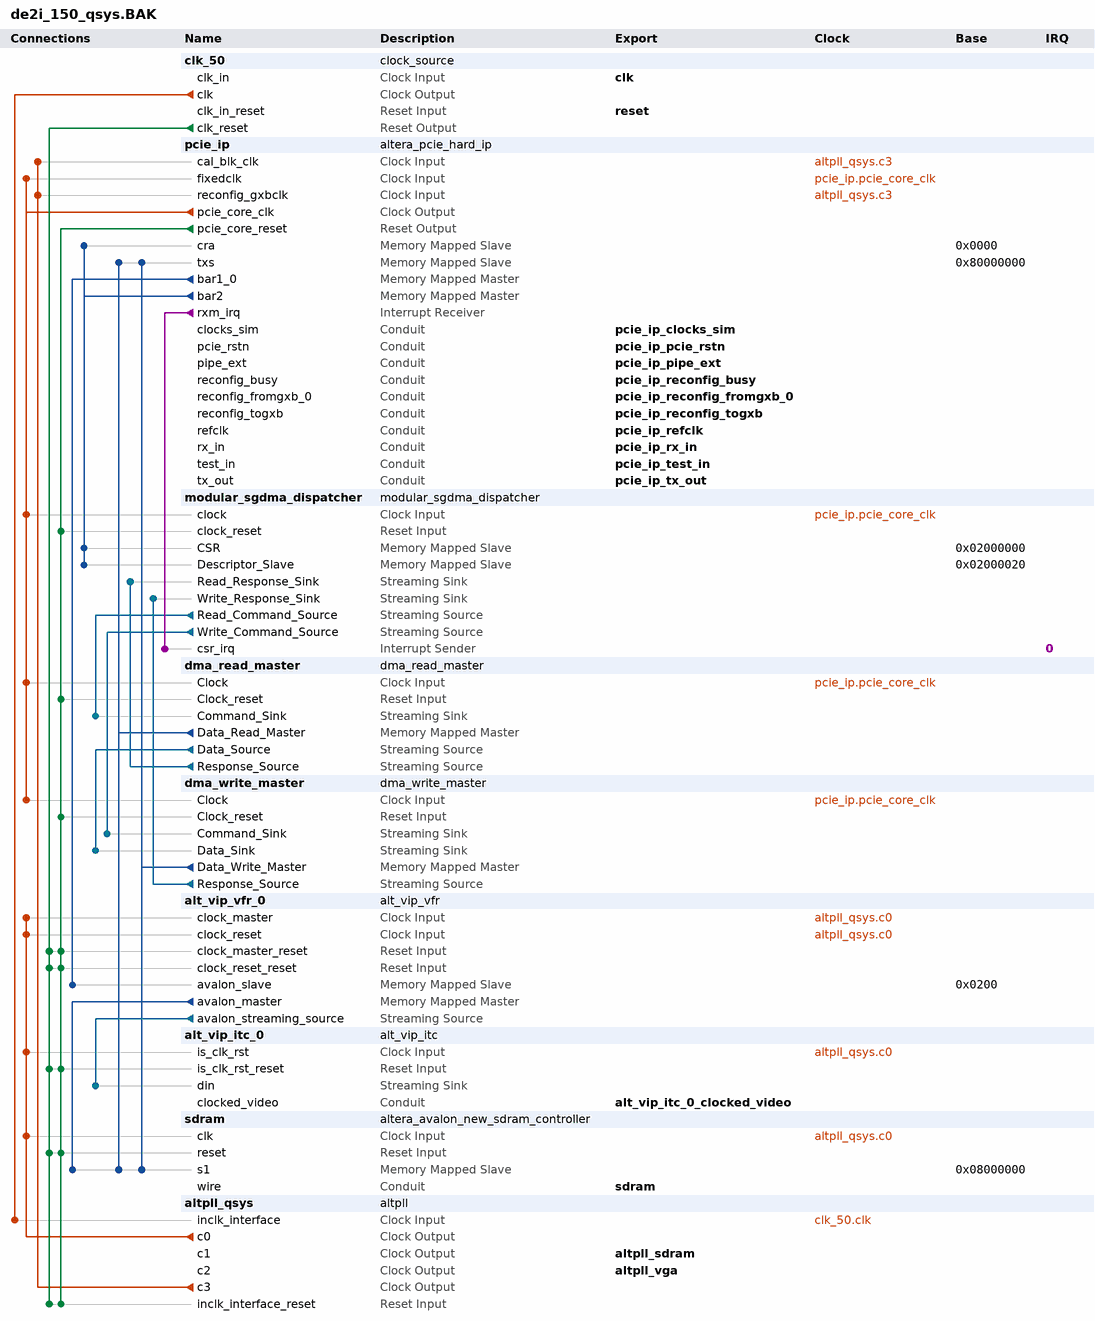
[diagram p0: system contents]
# Platform Designer (Qsys) system de2i_150_qsys.BAK, Cyclone IV GX EP4CGX150DF31C7
# Parameters at their usual value, and those the tool derives, are not listed.
package require -exact qsys 17.1
create_system de2i_150_qsys.BAK
set_project_property DEVICE_FAMILY {Cyclone IV GX}
set_project_property DEVICE EP4CGX150DF31C7

add_instance clk_50 clock_source 17.1
set_instance_parameter_value clk_50 clockFrequency 50000000

add_instance pcie_ip altera_pcie_hard_ip 17.1
set_instance_parameter_value pcie_ip {BAR Type} {64 bit Prefetchable,Not used,32 bit Non-Prefetchable,Not used,Not used,Not used}
set_instance_parameter_value pcie_ip CB_A2P_ADDR_MAP_IS_FIXED 0
set_instance_parameter_value pcie_ip CB_A2P_ADDR_MAP_NUM_ENTRIES 2
set_instance_parameter_value pcie_ip CB_A2P_ADDR_MAP_PASS_THRU_BITS 24
set_instance_parameter_value pcie_ip CG_ENABLE_A2P_INTERRUPT 0
set_instance_parameter_value pcie_ip CG_NO_CPL_REORDERING 0
set_instance_parameter_value pcie_ip {PCIe Address 31:0} 0x00000000,0x00000000,0x00000000,0x00000000,0x00000000,0x00000000,0x00000000,0x00000000,0x00000000,0x00000000,0x00000000,0x00000000,0x00000000,0x00000000,0x00000000,0x00000000
set_instance_parameter_value pcie_ip {PCIe Address 63:32} 0x00000000,0x00000000,0x00000000,0x00000000,0x00000000,0x00000000,0x00000000,0x00000000,0x00000000,0x00000000,0x00000000,0x00000000,0x00000000,0x00000000,0x00000000,0x00000000
set_instance_parameter_value pcie_ip class_code 0
set_instance_parameter_value pcie_ip device_id 57345
set_instance_parameter_value pcie_ip my_advanced_errors false
set_instance_parameter_value pcie_ip my_enable_ecrc_check false
set_instance_parameter_value pcie_ip my_enable_ecrc_gen false
set_instance_parameter_value pcie_ip p_pcie_test_out_width None
set_instance_parameter_value pcie_ip p_user_msi_enable 0
set_instance_parameter_value pcie_ip subsystem_device_id 4
set_instance_parameter_value pcie_ip subsystem_vendor_id 4466
set_instance_parameter_value pcie_ip vendor_id 4466

add_instance modular_sgdma_dispatcher modular_sgdma_dispatcher 17.1
set_instance_parameter_value modular_sgdma_dispatcher BURST_ENABLE 0
set_instance_parameter_value modular_sgdma_dispatcher BURST_WRAPPING_SUPPORT 0
set_instance_parameter_value modular_sgdma_dispatcher CSR_ADDRESS_WIDTH 3
set_instance_parameter_value modular_sgdma_dispatcher DATA_FIFO_DEPTH 32
set_instance_parameter_value modular_sgdma_dispatcher DATA_WIDTH 32
set_instance_parameter_value modular_sgdma_dispatcher DESCRIPTOR_FIFO_DEPTH 8
set_instance_parameter_value modular_sgdma_dispatcher ENHANCED_FEATURES 0
set_instance_parameter_value modular_sgdma_dispatcher GUI_RESPONSE_PORT 2
set_instance_parameter_value modular_sgdma_dispatcher MAX_BURST_COUNT 2
set_instance_parameter_value modular_sgdma_dispatcher MAX_BYTE 1024
set_instance_parameter_value modular_sgdma_dispatcher MAX_STRIDE 1
set_instance_parameter_value modular_sgdma_dispatcher MODE 0
set_instance_parameter_value modular_sgdma_dispatcher PREFETCHER_USE_CASE 0
set_instance_parameter_value modular_sgdma_dispatcher PROGRAMMABLE_BURST_ENABLE 0
set_instance_parameter_value modular_sgdma_dispatcher STRIDE_ENABLE 0
set_instance_parameter_value modular_sgdma_dispatcher TRANSFER_TYPE {Aligned Accesses}

add_instance dma_read_master dma_read_master 17.1
set_instance_parameter_value dma_read_master BURST_ENABLE 1
set_instance_parameter_value dma_read_master CHANNEL_ENABLE 0
set_instance_parameter_value dma_read_master CHANNEL_WIDTH 8
set_instance_parameter_value dma_read_master DATA_WIDTH 32
set_instance_parameter_value dma_read_master ERROR_ENABLE 0
set_instance_parameter_value dma_read_master ERROR_WIDTH 8
set_instance_parameter_value dma_read_master FIFO_DEPTH 4096
set_instance_parameter_value dma_read_master FIFO_SPEED_OPTIMIZATION 1
set_instance_parameter_value dma_read_master FIX_ADDRESS_WIDTH 32
set_instance_parameter_value dma_read_master GUI_BURST_WRAPPING_SUPPORT 0
set_instance_parameter_value dma_read_master GUI_MAX_BURST_COUNT 16
set_instance_parameter_value dma_read_master GUI_PROGRAMMABLE_BURST_ENABLE 0
set_instance_parameter_value dma_read_master GUI_STRIDE_WIDTH 1
set_instance_parameter_value dma_read_master LENGTH_WIDTH 23
set_instance_parameter_value dma_read_master PACKET_ENABLE 0
set_instance_parameter_value dma_read_master STRIDE_ENABLE 0
set_instance_parameter_value dma_read_master TRANSFER_TYPE {Unaligned Accesses}
set_instance_parameter_value dma_read_master USE_FIX_ADDRESS_WIDTH 0

add_instance dma_write_master dma_write_master 17.1
set_instance_parameter_value dma_write_master BURST_ENABLE 1
set_instance_parameter_value dma_write_master DATA_WIDTH 32
set_instance_parameter_value dma_write_master ERROR_ENABLE 0
set_instance_parameter_value dma_write_master ERROR_WIDTH 8
set_instance_parameter_value dma_write_master FIFO_DEPTH 4096
set_instance_parameter_value dma_write_master FIFO_SPEED_OPTIMIZATION 1
set_instance_parameter_value dma_write_master FIX_ADDRESS_WIDTH 32
set_instance_parameter_value dma_write_master GUI_BURST_WRAPPING_SUPPORT 0
set_instance_parameter_value dma_write_master GUI_MAX_BURST_COUNT 16
set_instance_parameter_value dma_write_master GUI_PROGRAMMABLE_BURST_ENABLE 0
set_instance_parameter_value dma_write_master GUI_STRIDE_WIDTH 1
set_instance_parameter_value dma_write_master LENGTH_WIDTH 23
set_instance_parameter_value dma_write_master PACKET_ENABLE 0
set_instance_parameter_value dma_write_master STRIDE_ENABLE 0
set_instance_parameter_value dma_write_master TRANSFER_TYPE {Unaligned Accesses}
set_instance_parameter_value dma_write_master USE_FIX_ADDRESS_WIDTH 0

add_instance alt_vip_vfr_0 alt_vip_vfr 14.0
set_instance_parameter_value alt_vip_vfr_0 MAX_IMAGE_HEIGHT 480
set_instance_parameter_value alt_vip_vfr_0 MAX_IMAGE_WIDTH 640
set_instance_parameter_value alt_vip_vfr_0 MEM_PORT_WIDTH 32
set_instance_parameter_value alt_vip_vfr_0 NUMBER_OF_CHANNELS_IN_PARALLEL 3
set_instance_parameter_value alt_vip_vfr_0 RMASTER_FIFO_DEPTH 512

add_instance alt_vip_itc_0 alt_vip_itc 14.0
set_instance_parameter_value alt_vip_itc_0 FIFO_DEPTH 12800
set_instance_parameter_value alt_vip_itc_0 H_ACTIVE_PIXELS 640
set_instance_parameter_value alt_vip_itc_0 H_BACK_PORCH 48
set_instance_parameter_value alt_vip_itc_0 H_FRONT_PORCH 16
set_instance_parameter_value alt_vip_itc_0 H_SYNC_LENGTH 96
set_instance_parameter_value alt_vip_itc_0 NUMBER_OF_COLOUR_PLANES 3
set_instance_parameter_value alt_vip_itc_0 THRESHOLD 12799
set_instance_parameter_value alt_vip_itc_0 V_ACTIVE_LINES 480
set_instance_parameter_value alt_vip_itc_0 V_BACK_PORCH 33
set_instance_parameter_value alt_vip_itc_0 V_FRONT_PORCH 10
set_instance_parameter_value alt_vip_itc_0 V_SYNC_LENGTH 2

add_instance sdram altera_avalon_new_sdram_controller 17.1
set_instance_parameter_value sdram TAC 5.5
set_instance_parameter_value sdram TRCD 20.0
set_instance_parameter_value sdram TRP 20.0
set_instance_parameter_value sdram casLatency 3
set_instance_parameter_value sdram columnWidth 10
set_instance_parameter_value sdram dataWidth 32
set_instance_parameter_value sdram generateSimulationModel false
set_instance_parameter_value sdram model custom
set_instance_parameter_value sdram numberOfBanks 4
set_instance_parameter_value sdram numberOfChipSelects 1
set_instance_parameter_value sdram powerUpDelay 100.0
set_instance_parameter_value sdram refreshPeriod 15.625
set_instance_parameter_value sdram rowWidth 13

add_instance altpll_qsys altpll 17.1
set_instance_parameter_value altpll_qsys CLK0_DIVIDE_BY 1
set_instance_parameter_value altpll_qsys CLK0_MULTIPLY_BY 3
set_instance_parameter_value altpll_qsys CLK1_DIVIDE_BY 1
set_instance_parameter_value altpll_qsys CLK1_DUTY_CYCLE 50
set_instance_parameter_value altpll_qsys CLK1_MULTIPLY_BY 3
set_instance_parameter_value altpll_qsys CLK1_PHASE_SHIFT -1852
set_instance_parameter_value altpll_qsys CLK2_DIVIDE_BY 2
set_instance_parameter_value altpll_qsys CLK2_DUTY_CYCLE 50
set_instance_parameter_value altpll_qsys CLK2_MULTIPLY_BY 1
set_instance_parameter_value altpll_qsys CLK2_PHASE_SHIFT 0
set_instance_parameter_value altpll_qsys CLK3_DIVIDE_BY 1
set_instance_parameter_value altpll_qsys CLK3_DUTY_CYCLE 50
set_instance_parameter_value altpll_qsys CLK3_MULTIPLY_BY 2
set_instance_parameter_value altpll_qsys CLK3_PHASE_SHIFT 0
set_instance_parameter_value altpll_qsys INCLK0_INPUT_FREQUENCY 20000
set_instance_parameter_value altpll_qsys PORT_ARESET PORT_USED
set_instance_parameter_value altpll_qsys PORT_LOCKED PORT_USED
set_instance_parameter_value altpll_qsys PORT_clk1 PORT_USED
set_instance_parameter_value altpll_qsys PORT_clk2 PORT_USED
set_instance_parameter_value altpll_qsys PORT_clk3 PORT_USED

# connections
add_connection altpll_qsys.c0 alt_vip_itc_0.is_clk_rst clock
add_connection altpll_qsys.c0 alt_vip_vfr_0.clock_master clock
add_connection altpll_qsys.c0 alt_vip_vfr_0.clock_reset clock
add_connection altpll_qsys.c0 sdram.clk clock
add_connection altpll_qsys.c3 pcie_ip.cal_blk_clk clock
add_connection altpll_qsys.c3 pcie_ip.reconfig_gxbclk clock
add_connection clk_50.clk altpll_qsys.inclk_interface clock
add_connection pcie_ip.pcie_core_clk dma_read_master.Clock clock
add_connection pcie_ip.pcie_core_clk dma_write_master.Clock clock
add_connection pcie_ip.pcie_core_clk modular_sgdma_dispatcher.clock clock
add_connection pcie_ip.pcie_core_clk pcie_ip.fixedclk clock
add_connection clk_50.clk_reset alt_vip_itc_0.is_clk_rst_reset reset
add_connection clk_50.clk_reset alt_vip_vfr_0.clock_master_reset reset
add_connection clk_50.clk_reset alt_vip_vfr_0.clock_reset_reset reset
add_connection clk_50.clk_reset altpll_qsys.inclk_interface_reset reset
add_connection clk_50.clk_reset sdram.reset reset
add_connection pcie_ip.pcie_core_reset alt_vip_itc_0.is_clk_rst_reset reset
add_connection pcie_ip.pcie_core_reset alt_vip_vfr_0.clock_master_reset reset
add_connection pcie_ip.pcie_core_reset alt_vip_vfr_0.clock_reset_reset reset
add_connection pcie_ip.pcie_core_reset altpll_qsys.inclk_interface_reset reset
add_connection pcie_ip.pcie_core_reset dma_read_master.Clock_reset reset
add_connection pcie_ip.pcie_core_reset dma_write_master.Clock_reset reset
add_connection pcie_ip.pcie_core_reset modular_sgdma_dispatcher.clock_reset reset
add_connection pcie_ip.pcie_core_reset sdram.reset reset
add_connection alt_vip_vfr_0.avalon_master sdram.s1 avalon
set_connection_parameter_value alt_vip_vfr_0.avalon_master/sdram.s1 arbitrationPriority 20
set_connection_parameter_value alt_vip_vfr_0.avalon_master/sdram.s1 baseAddress 0x08000000
add_connection dma_read_master.Data_Read_Master pcie_ip.txs avalon
set_connection_parameter_value dma_read_master.Data_Read_Master/pcie_ip.txs baseAddress 0x80000000
add_connection dma_read_master.Data_Read_Master sdram.s1 avalon
set_connection_parameter_value dma_read_master.Data_Read_Master/sdram.s1 baseAddress 0x08000000
add_connection dma_write_master.Data_Write_Master pcie_ip.txs avalon
set_connection_parameter_value dma_write_master.Data_Write_Master/pcie_ip.txs baseAddress 0x80000000
add_connection dma_write_master.Data_Write_Master sdram.s1 avalon
set_connection_parameter_value dma_write_master.Data_Write_Master/sdram.s1 baseAddress 0x08000000
add_connection pcie_ip.bar1_0 alt_vip_vfr_0.avalon_slave avalon
set_connection_parameter_value pcie_ip.bar1_0/alt_vip_vfr_0.avalon_slave baseAddress 0x0200
add_connection pcie_ip.bar2 modular_sgdma_dispatcher.CSR avalon
set_connection_parameter_value pcie_ip.bar2/modular_sgdma_dispatcher.CSR baseAddress 0x02000000
add_connection pcie_ip.bar2 modular_sgdma_dispatcher.Descriptor_Slave avalon
set_connection_parameter_value pcie_ip.bar2/modular_sgdma_dispatcher.Descriptor_Slave baseAddress 0x02000020
add_connection pcie_ip.bar2 pcie_ip.cra avalon
set_connection_parameter_value pcie_ip.bar2/pcie_ip.cra baseAddress 0x0000
add_connection alt_vip_vfr_0.avalon_streaming_source alt_vip_itc_0.din avalon_streaming
add_connection dma_read_master.Data_Source dma_write_master.Data_Sink avalon_streaming
add_connection dma_read_master.Response_Source modular_sgdma_dispatcher.Read_Response_Sink avalon_streaming
add_connection dma_write_master.Response_Source modular_sgdma_dispatcher.Write_Response_Sink avalon_streaming
add_connection modular_sgdma_dispatcher.Read_Command_Source dma_read_master.Command_Sink avalon_streaming
add_connection modular_sgdma_dispatcher.Write_Command_Source dma_write_master.Command_Sink avalon_streaming
add_connection pcie_ip.rxm_irq modular_sgdma_dispatcher.csr_irq interrupt
set_connection_parameter_value pcie_ip.rxm_irq/modular_sgdma_dispatcher.csr_irq irqNumber 0

# exported interfaces
add_interface alt_vip_itc_0_clocked_video conduit end
set_interface_property alt_vip_itc_0_clocked_video EXPORT_OF alt_vip_itc_0.clocked_video
add_interface altpll_sdram clock source
set_interface_property altpll_sdram EXPORT_OF altpll_qsys.c1
add_interface altpll_vga clock source
set_interface_property altpll_vga EXPORT_OF altpll_qsys.c2
add_interface clk clock sink
set_interface_property clk EXPORT_OF clk_50.clk_in
add_interface pcie_ip_clocks_sim conduit end
set_interface_property pcie_ip_clocks_sim EXPORT_OF pcie_ip.clocks_sim
add_interface pcie_ip_pcie_rstn conduit end
set_interface_property pcie_ip_pcie_rstn EXPORT_OF pcie_ip.pcie_rstn
add_interface pcie_ip_pipe_ext conduit end
set_interface_property pcie_ip_pipe_ext EXPORT_OF pcie_ip.pipe_ext
add_interface pcie_ip_reconfig_busy conduit end
set_interface_property pcie_ip_reconfig_busy EXPORT_OF pcie_ip.reconfig_busy
add_interface pcie_ip_reconfig_fromgxb_0 conduit end
set_interface_property pcie_ip_reconfig_fromgxb_0 EXPORT_OF pcie_ip.reconfig_fromgxb_0
add_interface pcie_ip_reconfig_togxb conduit end
set_interface_property pcie_ip_reconfig_togxb EXPORT_OF pcie_ip.reconfig_togxb
add_interface pcie_ip_refclk conduit end
set_interface_property pcie_ip_refclk EXPORT_OF pcie_ip.refclk
add_interface pcie_ip_rx_in conduit end
set_interface_property pcie_ip_rx_in EXPORT_OF pcie_ip.rx_in
add_interface pcie_ip_test_in conduit end
set_interface_property pcie_ip_test_in EXPORT_OF pcie_ip.test_in
add_interface pcie_ip_tx_out conduit end
set_interface_property pcie_ip_tx_out EXPORT_OF pcie_ip.tx_out
add_interface reset reset sink
set_interface_property reset EXPORT_OF clk_50.clk_in_reset
add_interface sdram conduit end
set_interface_property sdram EXPORT_OF sdram.wire

set_interconnect_requirement {$system} qsys_mm.clockCrossingAdapter HANDSHAKE
set_interconnect_requirement {$system} qsys_mm.maxAdditionalLatency 1

save_system de2i_150_qsys.BAK.qsys
